# EAGLE schematic RespirationRevB (EAGLE 9.0.1)
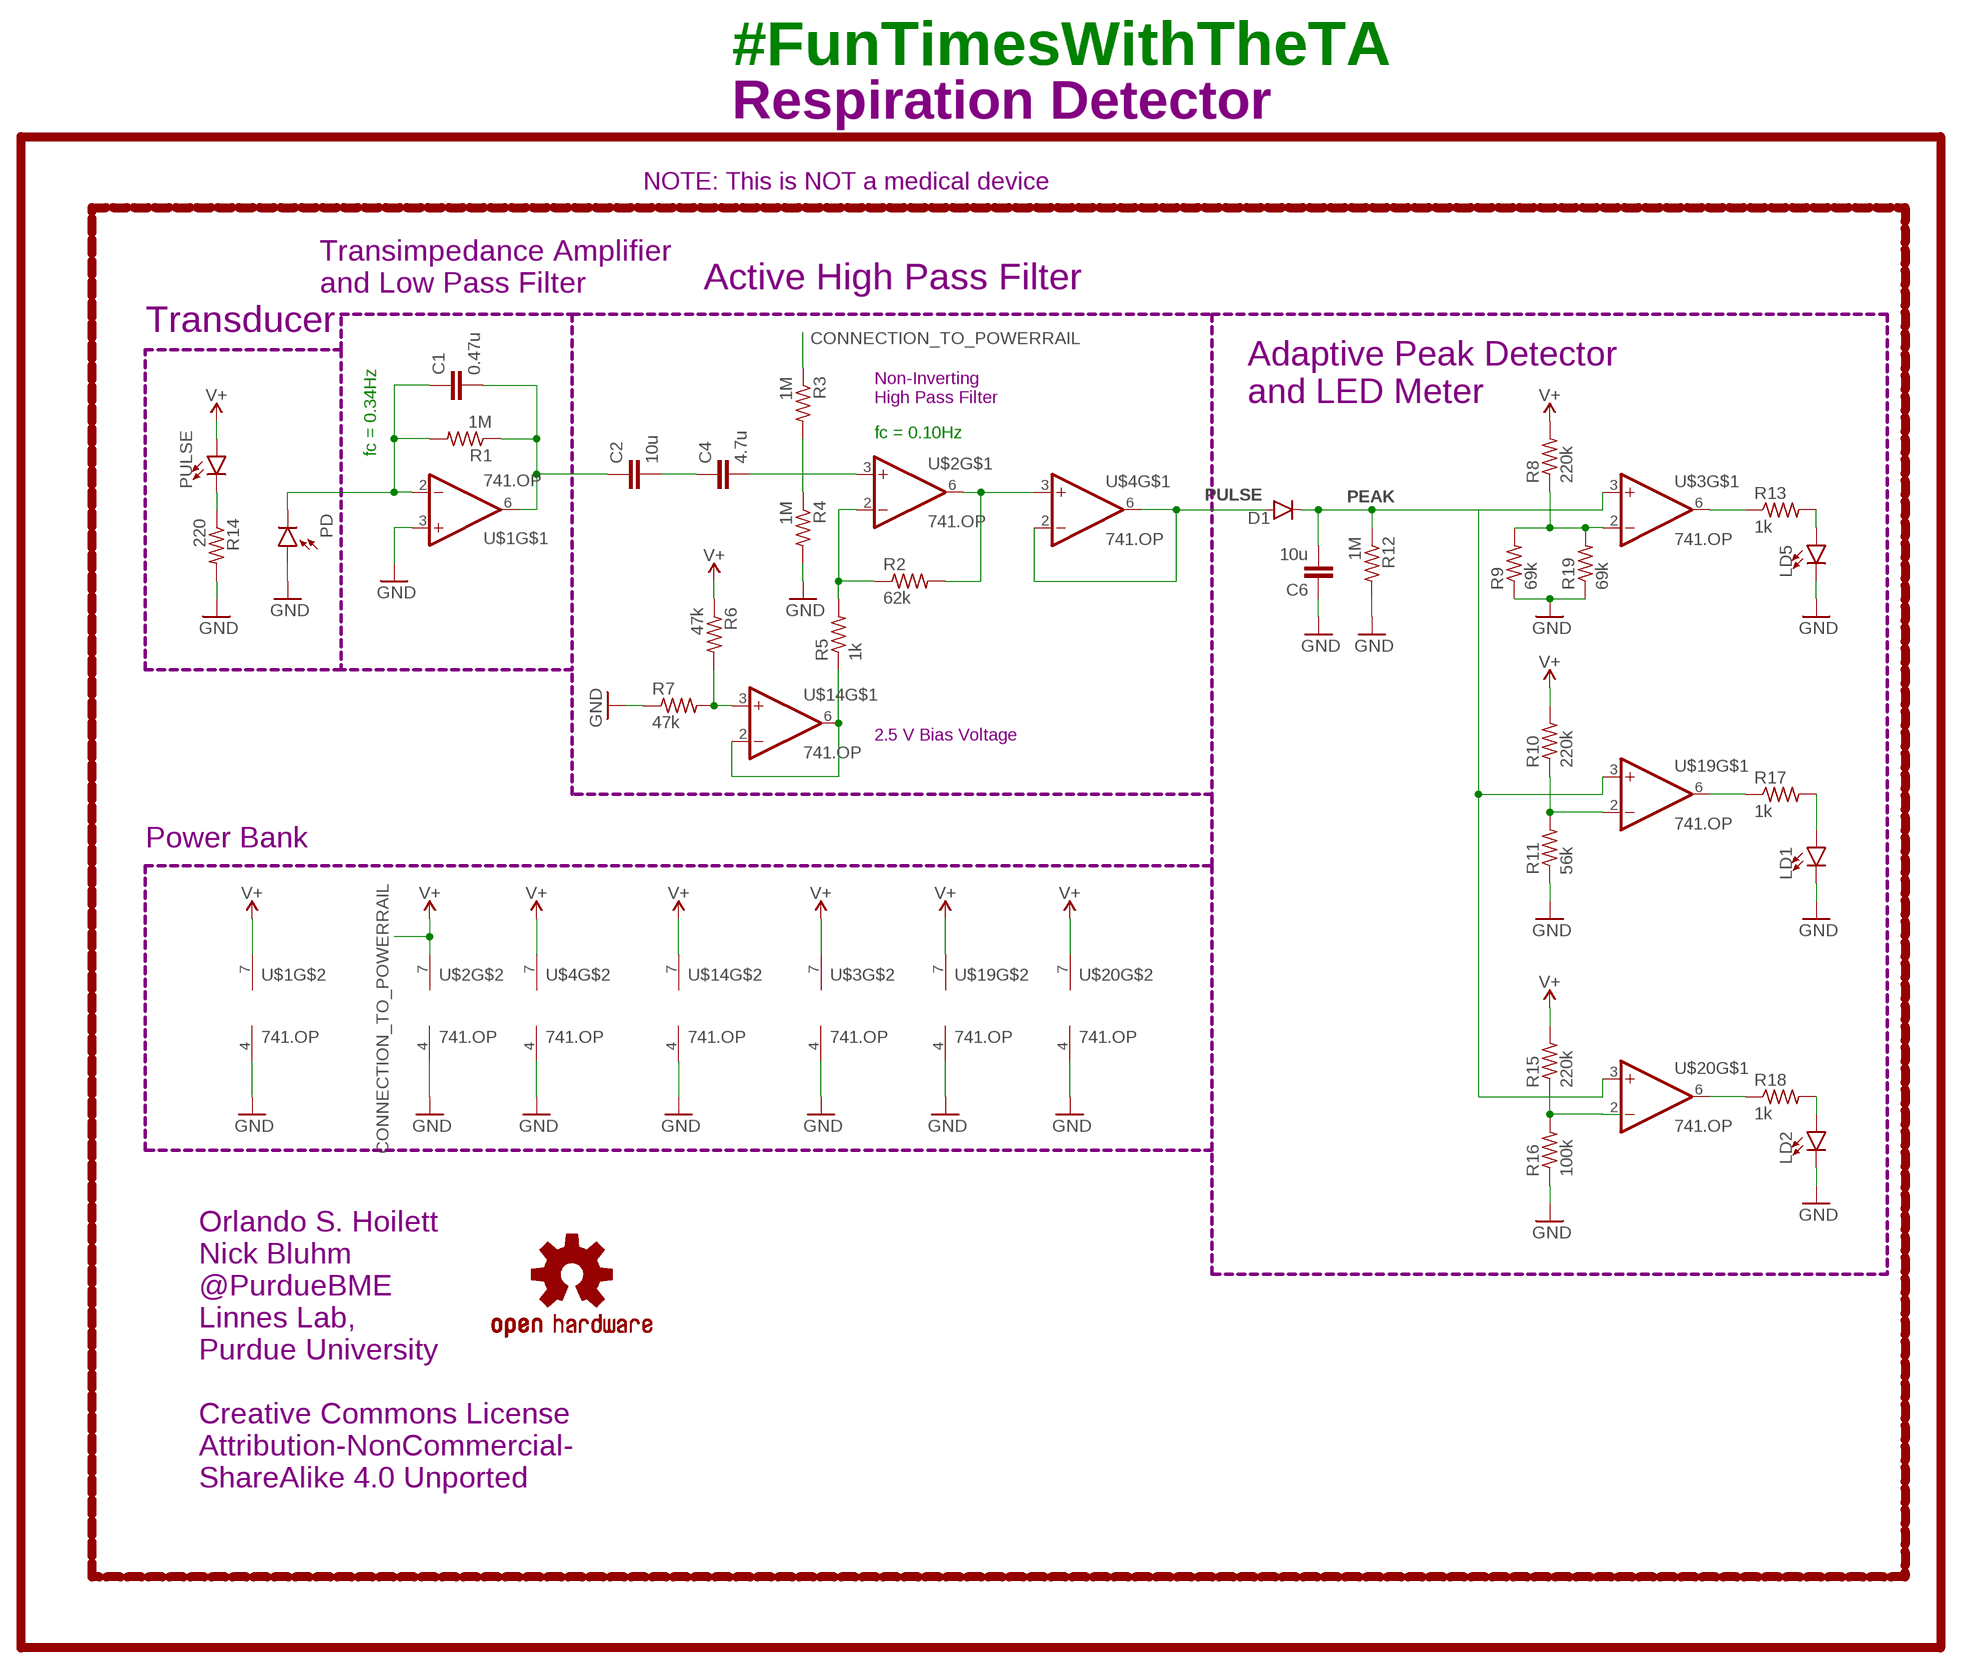
[diagram p0: schematic, sheet 1]

## Parts
C1  0.47u  C-EUC0402  [C0402]
C2  10u  C-EUC0402  [C0402]
C4  4.7u  C-EUC0402  [C0402]
C6  10u  C-EUC0805  [C0805]
D1  250mA/100V  DIODEBAS16  [SOD-323]
LD1  LED5MM  [LED_5MM]
LD2  LED5MM  [LED_5MM]
LD5  LED5MM  [LED_5MM]
LOGO1  OSHW-LOGOS  [OSHW-LOGO-S]
PD  PHOTODIODE-5MM  [PD_5MM]
PULSE  LED5MM  [LED_5MM]
R1  1M  R-US_R0402  [R0402]
R2  62k  R-US_R0402  [R0402]
R3  1M  R-US_R0402  [R0402]
R4  1M  R-US_R0402  [R0402]
R5  1k  R-US_R0402  [R0402]
R6  47k  R-US_R0402  [R0402]
R7  47k  R-US_R0402  [R0402]
R8  220k  R-US_R0402  [R0402]
R9  69k  R-US_R0402  [R0402]
R10  220k  R-US_R0402  [R0402]
R11  56k  R-US_R0402  [R0402]
R12  1M  R-US_R0402  [R0402]
R13  1k  R-US_R0402  [R0402]
R14  220  R-US_R0402  [R0402]
R15  220k  R-US_R0402  [R0402]
R16  100k  R-US_R0402  [R0402]
R17  1k  R-US_R0402  [R0402]
R18  1k  R-US_R0402  [R0402]
R19  69k  R-US_R0402  [R0402]
U$1  741.OP  [DIL08]
U$2  741.OP  [DIL08]
U$3  741.OP  [DIL08]
U$4  741.OP  [DIL08]
U$14  741.OP  [DIL08]
U$19  741.OP  [DIL08]
U$20  741.OP  [DIL08]

## Nets
COMP: R13.1 U$3.6(OUT)
CONNECTION_TO_POWERRAIL: R3.1 U$2.7(V+) ; supply symbol labelled V+
GND: C6.1 LD1.K(C) LD2.K(C) LD5.K(C) PD.A R4.2 R7.1 R9.1 R11.1 R12.2 R14.2 R16.1 R19.1 U$1.3(+IN) U$1.4(V-) U$2.4(V-) U$3.4(V-) U$4.4(V-) U$14.4(V-) U$19.4(V-) U$20.4(V-)
N$1: C1.1 PD.K(C) R1.2 U$1.2(-IN)
N$2: C1.2 C2.1 R1.1 U$1.6(OUT)
N$3: C2.2 C4.1
N$4: C4.2 R3.2 R4.1 U$2.3(+IN)
N$5: R5.1 U$14.2(-IN) U$14.6(OUT)
N$6: R6.2 R7.2 U$14.3(+IN)
N$7: LD5.A R13.2
N$8: R8.1 R9.2 R19.2 U$3.2(-IN)
N$9: PULSE.K(C) R14.1
N$10: R2.1 R5.2 U$2.2(-IN)
N$11: LD1.A R17.2
N$12: R10.1 R11.2 U$19.2(-IN)
N$13: R15.1 R16.2 U$20.2(-IN)
N$14: R17.1 U$19.6(OUT)
N$15: LD2.A R18.2
N$16: R18.1 U$20.6(OUT)
PEAK: C6.2 D1.C R12.1 U$3.3(+IN) U$19.3(+IN) U$20.3(+IN)
PULSE: D1.A R2.2 U$2.6(OUT) U$4.2(-IN) U$4.3(+IN) U$4.6(OUT)
V+: PULSE.A R6.1 R8.2 R10.2 R15.2 U$1.7(V+) U$3.7(V+) U$4.7(V+) U$14.7(V+) U$19.7(V+) U$20.7(V+)

## Notes on the sheet
- #FunTimesWithTheTA
- Respiration Detector
- NOTE: This is NOT a medical device
- Active High Pass Filter
- Transimpedance Amplifier
  and Low Pass Filter
- Transducer
- Non-Inverting
  High Pass Filter
- Adaptive Peak Detector
  and LED Meter
- fc = 0.10Hz
- fc = 0.34Hz
- 2.5 V Bias Voltage
- Power Bank
- Orlando S. Hoilett
  Nick Bluhm
  @PurdueBME
  Linnes Lab,
  Purdue University
  
  Creative Commons License
  Attribution-NonCommercial-
  ShareAlike 4.0 Unported

## Library data of the parts
C1 C2 C4 C6 = resistor:C-EU: CAPACITOR, European symbol
D1 = SparkFun-DiscreteSemi:DIODE: Diode These are standard reverse protection diodes and small signal diodes. SMA package can handle up to about 1A. SOD-323 can handle about 200mA. What the SOD-323 package when ordering, there are some mfgs out there that are 5-pin packages.; PROD_ID: DIO-09646
LD1 LD2 LD5 PULSE = CalvEngIO-LED:LED: LED (Generic) Standard schematic elements and footprints for 5mm, 3mm, 1206, and 0603 sized LEDs. Generic LEDs with no color specified. LTST-C190KGKT: arrow indicates cathode
LOGO1 = SparkFun-Aesthetics:OSHW-LOGO: Open Source Hardware Logo This logo indicates the piece of hardware it is found on incorporates a OSHW license and/or adheres to the definition of open source hardware found here: http://freedomdefined.org/OSHW
PD = CalvEngIO-Sensors:PHOTODIODE
R1-R19 = resistor:R-US_: RESISTOR, American symbol
U$1-U$4 U$14 U$19 U$20 = CalvEngIO-AnalogIC:741.OP